# EAGLE design ArticulatedPCBEndLED (EAGLE 9.6.2)
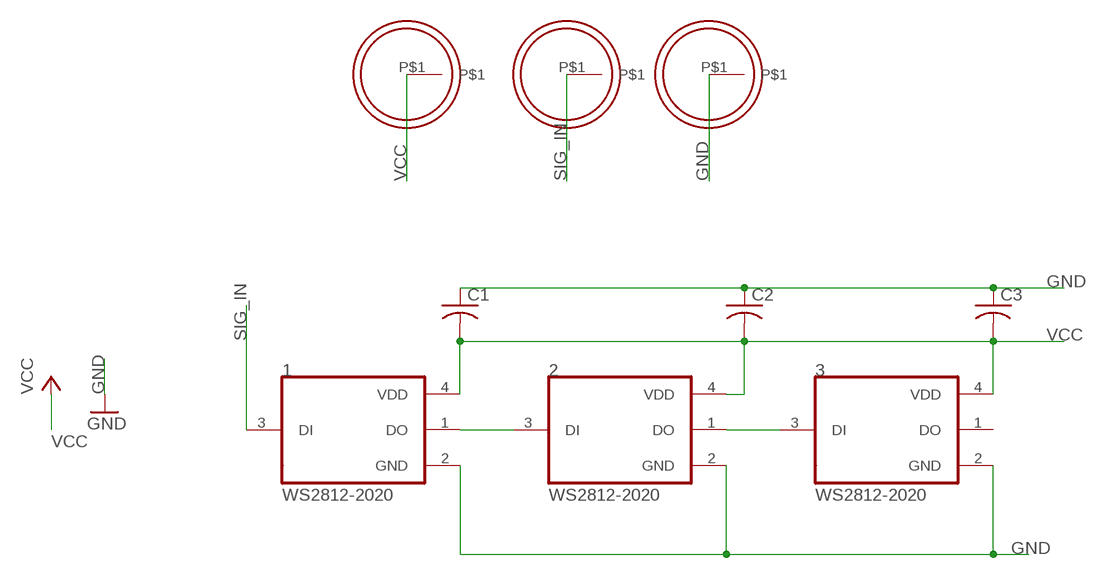
[diagram p0: schematic, sheet 1]

## Parts
1  WS2812-2020  [LED_WS2812-2020]
2  WS2812-2020  [LED_WS2812-2020]
3  WS2812-2020  [LED_WS2812-2020]
C1  C-USC0603  [C0603]
C2  C-USC0603  [C0603]
C3  C-USC0603  [C0603]
U$2  CIRCLE_PAD_17_2_OD  [CIRCLE_PAD_17_2_OD]
U$3  CIRCLE_PAD_8_2_OD  [CIRCLE_PAD_8_2_OD]
U$4  CIRCLE_PAD_12_7_OD  [CIRCLE_PAD_12_7_OD]

## Nets
GND: 1.2(GND) 2.2(GND) 3.2(GND) C1.1 C2.1 C3.1 U$2.P$1
N$1: 1.1(DO) 2.3(DI)
N$4: 2.1(DO) 3.3(DI)
SIG_IN: 1.3(DI) U$4.P$1
VCC: 1.4(VDD) 2.4(VDD) 3.4(VDD) C1.2 C2.2 C3.2 U$3.P$1
Unconnected: 3.1(DO)

## Library data of the parts
1-3 = WS2812-2020:WS2812-2020: Intelligent control LED integrated light source; AVAILABILITY: Unavailable; MF: Worldsemi; MP: WS2812-2020; PACKAGE: Package Analog Devices; PRICE: None
C1-C3 = adafruit:C-US: CAPACITOR, American symbol
U$2 = debra:CIRCLE_PAD_17_2_OD
U$3 = debra:CIRCLE_PAD_8_2_OD
U$4 = debra:CIRCLE_PAD_12_7_OD

## Board
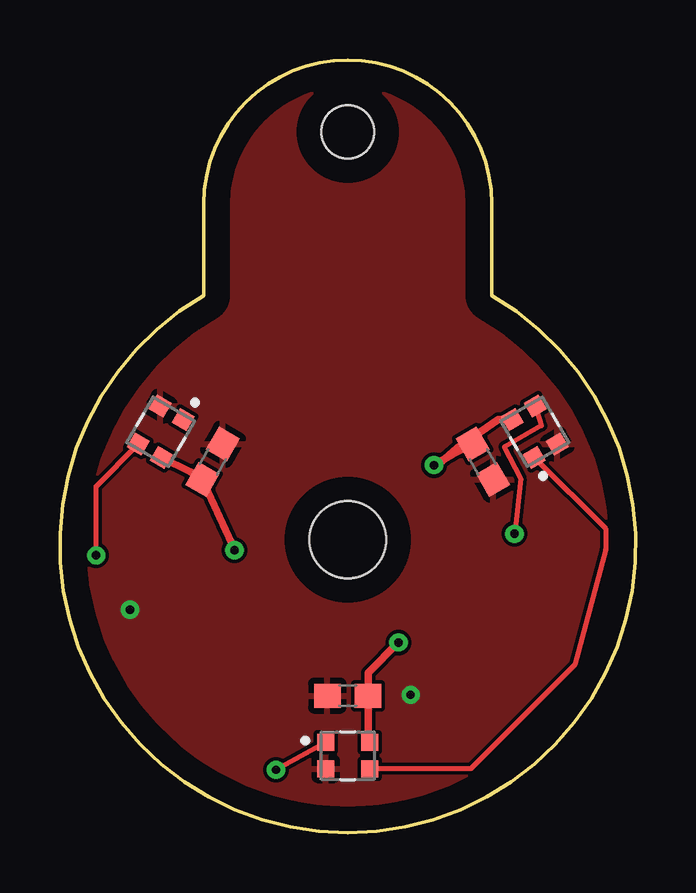
[diagram p1: board, top side]
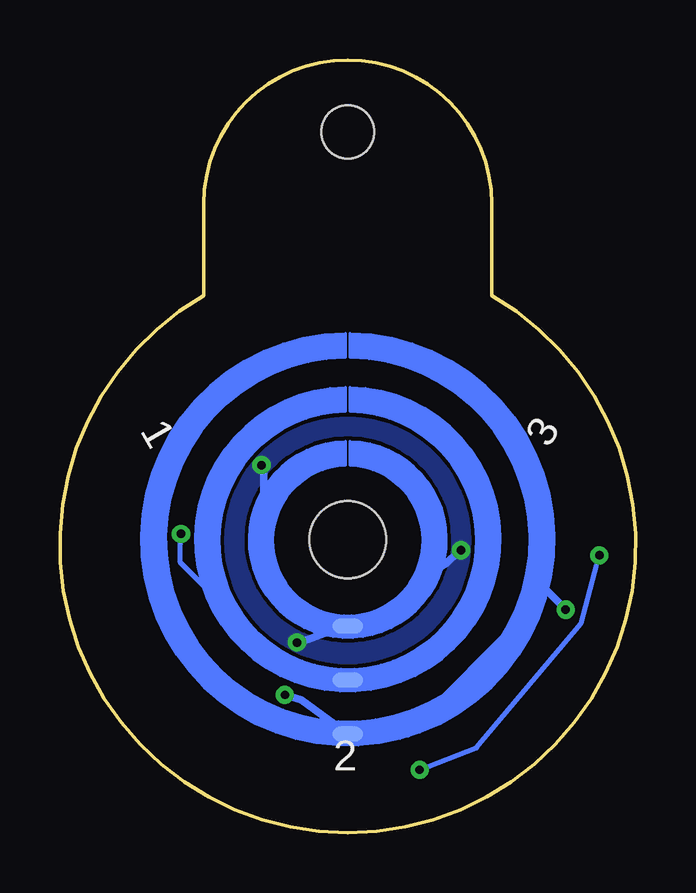
[diagram p2: board, bottom side, seen from below]

Size 23.98 x 32.21 mm. Coordinates in mm from the lower left corner, seen from the top.
Outline: 5.99,22.39 arc300 17.99,22.39 17.99,26.21 arc180 5.99,26.21 5.99,22.39
Copper layers (1*16): Top 0.035mm / dielectric 1.5mm / Bottom 0.035mm
Design rules "default *": minimum track width 6mil, minimum drill 0.35mm, track to track 6mil, track to pad 6mil, pad to pad 6mil, via to via 6mil, smd to smd 6mil, copper to edge 40mil, drill to drill 6mil, minimum pad ring 6mil, minimum via ring 8mil, stop-mask expansion 4mil, vias tented up to drill 16mil, thermal gap 10mil
Holes 3.2 mm at 11.99,12.21
Holes 2.2 mm at 11.99,29.21

### Footprints (pad centres in the part's own frame; a part is rotated, then mirrored left to right if it is on the bottom)
LED_WS2812-2020 = smd 0.7 x 0.7: 1 -0.915,0.55; 2 -0.915,-0.55; 3 0.915,-0.55; 4 0.915,0.55
C0603 = smd 1.1 x 1: 1 -0.85,0; 2 0.85,0
CIRCLE_PAD_17_2_OD = smd 1.27 x 0.635: P$1 0,-8.1
CIRCLE_PAD_8_2_OD = smd 1.27 x 0.635: P$1 0,-3.6
CIRCLE_PAD_12_7_OD = smd 1.27 x 0.635: P$1 0,-5.85

### Placement (x,y rotation side)
1  19.78,16.71 120 top
2  11.99,3.21 0 top
3  4.2,16.71 240 top
C1  17.62,15.46 120 top
C2  11.99,5.71 0 top
C3  6.36,15.46 240 top
U$2  11.99,12.21 0 bottom
U$3  11.99,12.21 0 bottom
U$4  11.99,12.21 0 bottom

### Tracks (layer width: path | path; a pad name or v marks a point on that pad's centre or on a via)
GND  (via drill 0.35)
  Bottom 0.305: v2.91,9.3 4.27,10.68 4.27,9.34 9.5,4.11 U$2.P$1 13.92,5.55 v14.61,5.75
  pour Top: -2.41,-1.01 -2.25,34.17 26.56,33.7 26.4,-1.49
N$1
  Top 0.203: 1.1 22.73,12.68 22.73,11.8 21.45,7 17.12,2.66 2.3
N$4  (via drill 0.35)
  Top 0.203: 2.1 v9,2.62 | v1.51,11.56 1.51,14.44 3.3
  Bottom 0.203: v9,2.62 6.64,3.54 2.27,8.73 v1.51,11.56
SIG_IN  (via drill 0.35)
  Top 0.203: 1.3 20.06,16.97 18.51,16.09 19.19,14.77 v18.94,12.46
  Bottom 0.203: v18.94,12.46 18.96,12.05 18.96,11.26 16.83,9.13 16.83,8.83 14.7,6.69 12.32,6.69 U$4.P$1
VCC  (via drill 0.35)
  Top 0.305: C1.2 16.35,15.76 v15.59,15.32 15.73,15.32 16.55,16.03 18.25,17.23 1.4 | 3.4 5.44,15.05 C3.2 v7.27,11.78 | v14.1,7.93 12.84,6.67 C2.2 12.84,3.83 2.4
  Bottom 0.305: v14.1,7.93 13.63,8.06 12.13,8.61 U$3.P$1 | v15.59,15.32 15.5,15.24 15.5,10.72 13.38,8.61 U$3.P$1 | v7.27,11.78 7.75,11.36 7.88,11.23 8.52,10.85 10.91,8.46 11.84,8.47 U$3.P$1
  pour Bottom: -2.28,-1.01 -2.23,34.16 26.58,33.84 26.53,-1.33